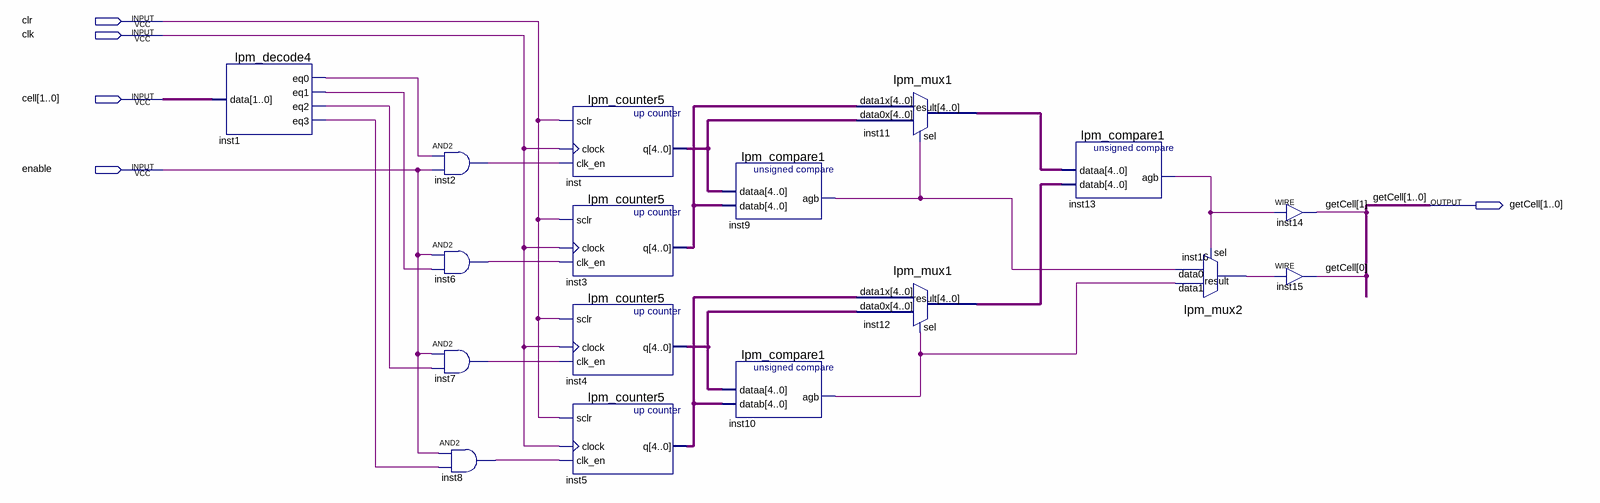
[diagram p0: schematic sheet]
// Quartus schematic RLBlock.bdf as structural Verilog: 17 symbols, 5 pins
module RLBlock (
  input  clr,
  input  clk,
  input  [1:0] \cell ,
  input  enable,
  output [1:0] getCell
);

  wire inst1_eq0, inst1_eq1, inst1_eq2, inst1_eq3, inst2_out, inst6_out, inst7_out, inst8_out, inst9_agb,
       inst10_agb, inst13_agb, inst16_result;
  wire [4:0] inst3_q, inst4_q, inst5_q, inst11_result, inst12_result, inst_q;

  lpm_decode4 inst1 (.data(\cell ), .eq0(inst1_eq0), .eq1(inst1_eq1), .eq2(inst1_eq2), .eq3(inst1_eq3));
  and inst2 (inst2_out, inst1_eq0, enable);
  and inst6 (inst6_out, enable, inst1_eq1);
  and inst7 (inst7_out, enable, inst1_eq2);
  and inst8 (inst8_out, enable, inst1_eq3);
  lpm_counter5 inst (.sclr(clr), .clock(clk), .clk_en(inst2_out), .q(inst_q));
  lpm_counter5 inst3 (.sclr(clr), .clock(clk), .clk_en(inst6_out), .q(inst3_q));
  lpm_counter5 inst4 (.sclr(clr), .clock(clk), .clk_en(inst7_out), .q(inst4_q));
  lpm_counter5 inst5 (.sclr(clr), .clock(clk), .clk_en(inst8_out), .q(inst5_q));
  lpm_compare1 inst9 (.dataa(inst_q), .datab(inst3_q), .agb(inst9_agb));
  lpm_compare1 inst10 (.dataa(inst4_q), .datab(inst5_q), .agb(inst10_agb));
  lpm_mux1 inst11 (.data1x(inst3_q), .data0x(inst_q), .sel(inst9_agb), .result(inst11_result));
  lpm_mux1 inst12 (.data1x(inst5_q), .data0x(inst4_q), .sel(inst10_agb), .result(inst12_result));
  lpm_compare1 inst13 (.dataa(inst11_result), .datab(inst12_result), .agb(inst13_agb));
  lpm_mux2 inst16 (.data1(inst10_agb), .data0(inst9_agb), .sel(inst13_agb), .result(inst16_result));
  assign getCell[1] = inst13_agb;  // WIRE inst14
  assign getCell[0] = inst16_result;  // WIRE inst15
endmodule
